# Altium schematic sheet 09)KEY,LED.SchDoc
size 297 x 209 mm
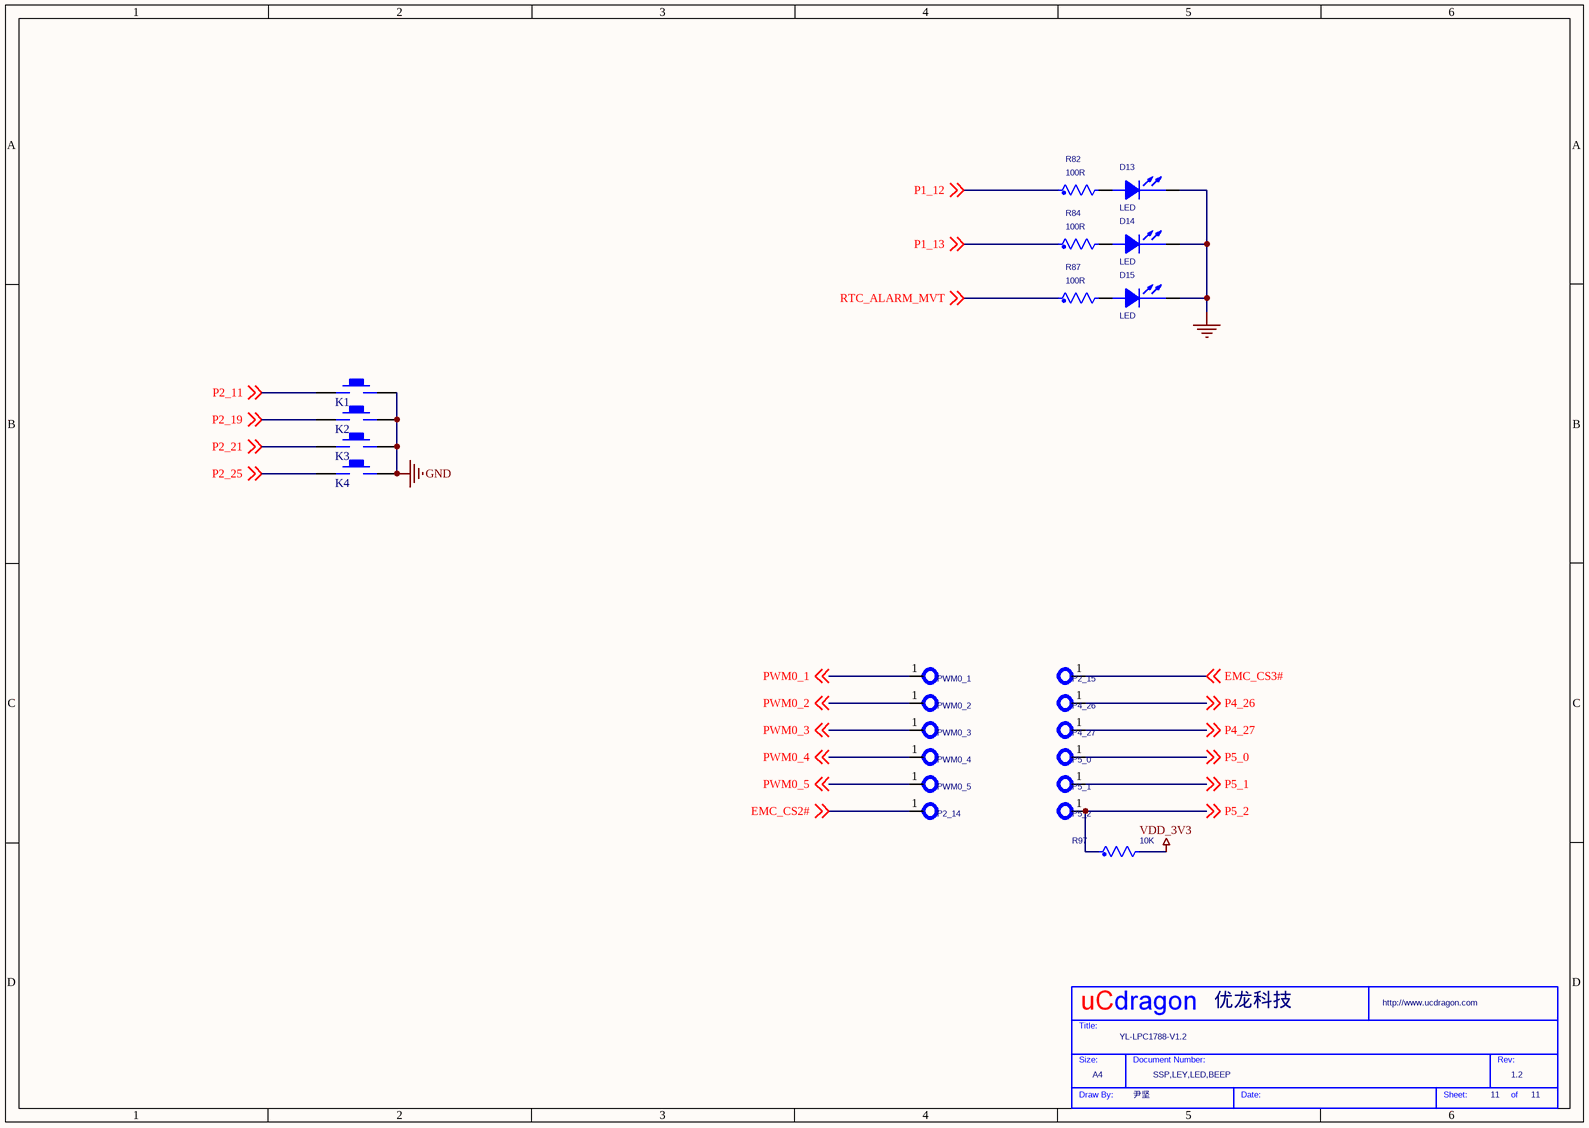
[diagram p0: 09)KEY,LED.SchDoc]

## Parts
*  Page Count: 11  Page Size: A4  Title: YL-LPC1788-V1.2  RevCode: 1.2  Doc: SSP,LEY,LED,BEEP  Drawing: 尹坚  Company: 优龙科技  (hidden comment: My Title 0)  (graphical)
D13  LED
D14  LED
D15  LED
K1  KEY_M  [K贴片]  (value not drawn)
K2  KEY_M  [K贴片]  (value not drawn)
K3  KEY_M  [K贴片]  (value not drawn)
K4  KEY_M  [K贴片]  (value not drawn)
R82  100R
R84  100R
R87  100R
R97  10K
TP5  PWM0_1
TP6  P2_15
TP7  PWM0_2
TP8  P4_26
TP9  PWM0_3
TP10  P4_27
TP11  PWM0_4
TP12  P5_0
TP13  PWM0_5
TP14  P5_1
TP15  P2_14
TP16  P5_2

## Nets
GND: K1.1 K2.1 K3.1 K4.1
GND_POWER: D13.2(CATHODE) D14.2(CATHODE) D15.2(CATHODE)
VDD_3V3: R97.2
EMC_CS2#: TP15.1 ; off-sheet EMC_CS2#
EMC_CS3#: TP6.1 ; off-sheet EMC_CS3#
P1_12: R82.1 ; off-sheet P1_12
P1_13: R84.1 ; off-sheet P1_13
P2_11: K1.2 ; off-sheet P2_11
P2_19: K2.2 ; off-sheet P2_19
P2_21: K3.2 ; off-sheet P2_21
P2_25: K4.2 ; off-sheet P2_25
P4_26: TP8.1 ; off-sheet P4_26
P4_27: TP10.1 ; off-sheet P4_27
P5_0: TP12.1 ; off-sheet P5_0
P5_1: TP14.1 ; off-sheet P5_1
P5_2: R97.1 TP16.1 ; off-sheet P5_2
PWM0_1: TP5.1 ; off-sheet PWM0_1
PWM0_2: TP7.1 ; off-sheet PWM0_2
PWM0_3: TP9.1 ; off-sheet PWM0_3
PWM0_4: TP11.1 ; off-sheet PWM0_4
PWM0_5: TP13.1 ; off-sheet PWM0_5
RTC_ALARM_MVT: R87.1 ; off-sheet RTC_ALARM_MVT
NetD13_1: D13.1(ANODE) R82.2
NetD14_1: D14.1(ANODE) R84.2
NetD15_1: D15.1(ANODE) R87.2

## Notes on the sheet
- (in symbol My Title 0) Title:; Size:; Document Number:; Rev:; Draw By:; Date:; Sheet:; of

## Library data of the parts
R82 R84 R87 R97 = R_Generic_Dup2
TP5-TP16 = TestPoint_1
* = My Title 0: Page Number: 11; Page Create Date: May 29, 2006; WebSite: http://www.ucdragon.com